# Altium schematic sheet CHARGING IC.SchDoc
size C
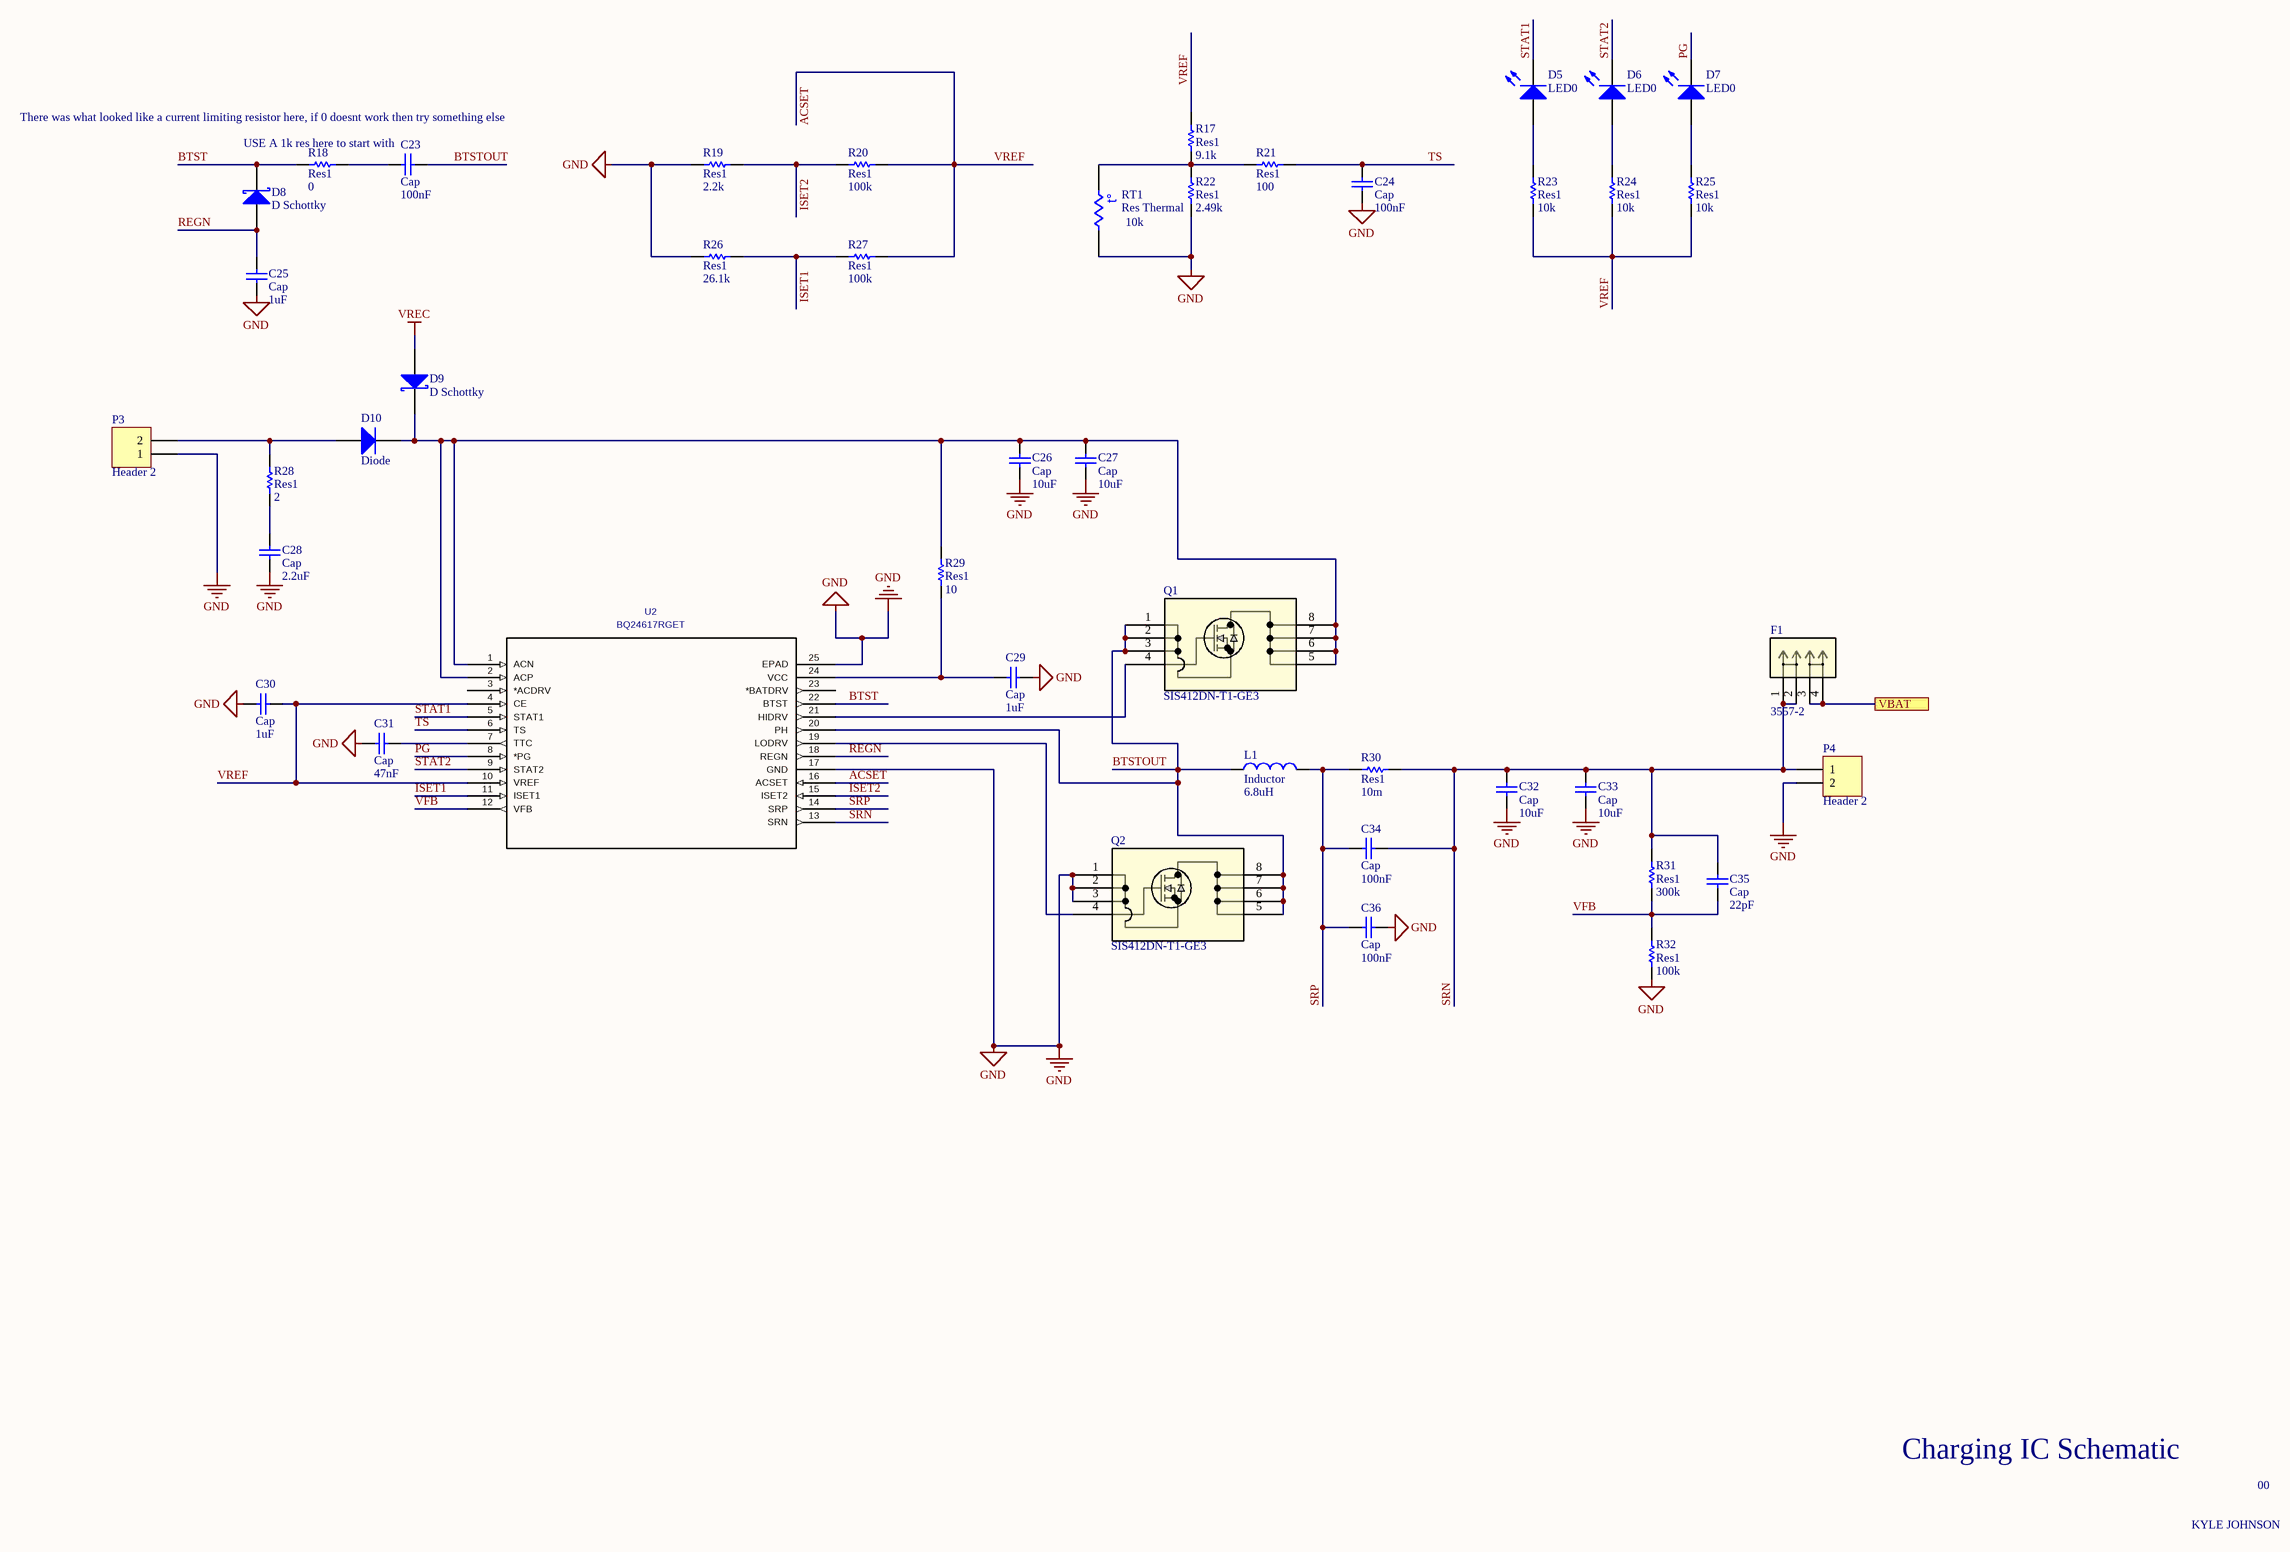
[diagram p0: CHARGING IC.SchDoc]

## Parts
C23  Cap  value 100nF  [0402-A]
C24  Cap  value 100nF  [0402-A]
C25  Cap  value 1uF  [0402-A]
C26  Cap  value 10uF  [6-0805_M]
C27  Cap  value 10uF  [6-0805_M]
C28  Cap  value 2.2uF  [1608[0603]]
C29  Cap  value 1uF  [0402-A]
C30  Cap  value 1uF  [0402-A]
C31  Cap  value 47nF  [0402-A]
C32  Cap  value 10uF  [6-0805_M]
C33  Cap  value 10uF  [6-0805_M]
C34  Cap  value 100nF  [0402-A]
C35  Cap  value 22pF  [0402-A]
C36  Cap  value 100nF  [0402-A]
D5  LED0  [1608[0603]]
D6  LED0  [1608[0603]]
D7  LED0  [1608[0603]]
D8  D Schottky  [425]
D9  D Schottky  [425]
D10  Diode  [X3-WLB1608-2]
F1  3557-2  [CONN_3557-2_KEY]
L1  Inductor  value 6.8uH  [IHLP2525CZER6R8MA1]
P3  Header 2  [2-1445096-2]
P4  Header 2  [2-1445096-2]
Q1  SIS412DN-T1-GE3  [POWERPAK_1212-8]
Q2  SIS412DN-T1-GE3  [POWERPAK_1212-8]
R17  Res1  value 9.1k  [0402-A]
R18  Res1  value 0  [0402-A]
R19  Res1  value 2.2k  [0402-A]
R20  Res1  value 100k  [0402-A]
R21  Res1  value 100  [0402-A]
R22  Res1  value 2.49k  [0402-A]
R23  Res1  value 10k  [0402-A]
R24  Res1  value 10k  [0402-A]
R25  Res1  value 10k  [0402-A]
R26  Res1  value 26.1k  [0402-A]
R27  Res1  value 100k  [0402-A]
R28  Res1  value 2  [6-0805_M]
R29  Res1  value 10  [0402-A]
R30  Res1  value 10m  [6-0805_M]
R31  Res1  value 300k  [0402-A]
R32  Res1  value 100k  [0402-A]
RT1  Res Thermal  value 10k  [1608[0603]]
U2  BQ24617RGET  [RGE24_2P45X2P45]

## Ports
VBAT

## Nets
GND: C24.1 C25.1 C26.1 C27.1 C28.1 C29.2 C30.2 C31.1 C32.1 C33.1 C36.2 P3.1 P4.2 Q2.1(S) Q2.2(S) Q2.3(S) R19.1 R22.1 R26.1 R32.1 RT1.2 U2.17(GND) U2.25(EPAD)
VREC: D9.1(A)
ACSET: C30.1 R17.2 R20.2 R23.1 R24.1 R25.1 R27.2 U2.4(CE) U2.10(VREF) U2.16(ACSET)  [also labelled VREF]
BTST: D8.2(K) R18.1 U2.22(BTST)
BTSTOUT: C23.2 L1.1 Q1.1(S) Q1.2(S) Q1.3(S) Q2.5(D) Q2.6(D) Q2.7(D) Q2.8(D) U2.20(PH)
ISET1: R26.2 R27.1 U2.11(ISET1)
ISET2: R19.2 R20.1 U2.15(ISET2)
PG: D7.2(K) U2.8(*PG)
REGN: C25.2 D8.1(A) U2.18(REGN)
SRN: C32.2 C33.2 C34.1 C35.1 F1.1 F1.2 P4.1 R30.2 R31.2 U2.13(SRN)
SRP: C34.2 C36.1 L1.2 R30.1 U2.14(SRP)
STAT1: D5.2(K) U2.5(STAT1)
STAT2: D6.2(K) U2.9(STAT2)
TS: C24.2 R21.2 U2.6(TS)
VBAT: F1.3 F1.4 ; port VBAT
VFB: C35.2 R31.1 R32.2 U2.12(VFB)
NetC23_1: C23.1 R18.2
NetC26_2: C26.2 C27.2 D9.2(K) D10.2(K) Q1.5(D) Q1.6(D) Q1.7(D) Q1.8(D) R29.2 U2.1(ACN) U2.2(ACP)
NetC28_2: C28.2 R28.1
NetC29_1: C29.1 R29.1 U2.24(VCC)
NetC31_2: C31.2 U2.7(TTC)
NetD5_1: D5.1(A) R23.2
NetD6_1: D6.1(A) R24.2
NetD7_1: D7.1(A) R25.2
NetD10_1: D10.1(A) P3.2 R28.2
NetQ1_4: Q1.4(G) U2.21(HIDRV)
NetQ2_4: Q2.4(G) U2.19(LODRV)
NetR17_1: R17.1 R21.1 R22.2 RT1.1

Not connected (* = marked no-connect by the designer): U2 3(*ACDRV) 23(*BATDRV)

## Notes on the sheet
- There was what looked like a current limiting resistor here, if 0 doesnt work then try something else
- USE A 1k res here to start with
- Charging IC Schematic
- KYLE JOHNSON
- 00
- (in symbol Res Thermal) t°

## Library data of the parts
C23-C36 = Cap: Capacitor; Published: 8-Jun-2000; LatestRevisionDate: 17-Jul-2002; LatestRevisionNote: Re-released for DXP Platform.; PackageReference: RAD-0.3; Publisher: Altium Limited; PackageDescription: Radial Cap, Thru-Hole; 2 Leads; 0.3 in Pin Spacing
D8 D9 = D Schottky: Schottky Diode; Published: 8-Jun-2000; LatestRevisionDate: 17-Jul-2002; LatestRevisionNote: Re-released for DXP Platform.; PackageReference: SMB; Publisher: Altium Limited; PackageDescription: DO-214-AA/SMB; 2 C-Bend Leads; Body 5.3 x 3.6 mm, inc. leads (LxW); Code_JEDEC: DO-214-AA
D10 = Diode: Default Diode; Published: 8-Jun-2000; LatestRevisionDate: 17-Jul-2002; LatestRevisionNote: Re-released for DXP Platform.; PackageVersion: Sep-1996; PackageReference: SMC; Publisher: Altium Limited; PackageDescription: DO-214-AB/SMC; 2 C-Bend Leads; Body 7.9 x 5.9 mm, inc. leads (LxW); Code_JEDEC: DO-214-AB
F1 = 3557-2: No Description Available; Vendor: Keystone Electronics; Built_By: EMA_Cory; SourceLibrary: Keystone Electronics_Complete_2020-01-22; Type: DEV; Manufacturer_Part_Number: 3557-2; Copyright: Copyright (C) 2018 Accelerated Designs. All rights reserved; RefDes: RefDes
L1 = Inductor: Code_IEC: 1005; Published: 8-Jun-2000; LatestRevisionDate: 29-May-2009; LatestRevisionNote: IPC-7351 Footprint Added.; PackageReference: 0402-A; Publisher: Altium Limited; PackageDescription: Chip Inductor; Code_JEITA: 0402
P3 P4 = Header 2: Header, 2-Pin; LatestRevisionDate: 17-Jul-2002; LatestRevisionNote: Re-released for DXP Platform.; Publisher: Altium Limited
Q1 Q2 = SIS412DN-T1-GE3: No Description Available; Vendor: Vishay; Built_By: EMA_Cory; Type: DEV; Datasheet: https://www.vishay.com/docs/69006/sis412dn.pdf; Manufacturer_Part_Number: SIS412DN-T1-GE3; Copyright: Copyright (C) 2018 Accelerated Designs. All rights reserved; RefDes: RefDes
R17-R32 = Res1: Resistor; Published: 8-Jun-2000; LatestRevisionDate: 17-Jul-2002; LatestRevisionNote: Re-released for DXP Platform.; PackageReference: AXIAL-0.3; Publisher: Altium Limited; PackageDescription: Axial Device, Thru-Hole; 2 Leads; 0.3 in Pin Spacing
RT1 = Res Thermal: Thermistor; Published: 24-Mar-1999; LatestRevisionDate: 29-May-2009; LatestRevisionNote: IPC-7351 Footprint Added.; PackageVersion: Mar-2003; PackageReference: 6-0805; Publisher: Altium Limited; PackageDescription: Chip Resistor 0805 Case Size; Code_IPC: RESC2012
U2 = BQ24617RGET: Manufacturer: Texas Instruments; C: Copyright (C) 2015 Accelerated Designs. All rights reserved; Built_By: EMA_UL_Team; Value: BQ24617RGET; Vendor: Vendor; Manufacturer_Part_Number: BQ24617RGET
D5-D7 = LED0: Published: 8-Jun-2000; LatestRevisionDate: 08-Jul-2005; LatestRevisionNote: Mech Layer 1 removed.; PackageReference: LED-0; Publisher: Altium Limited; PackageDescription: LED; 2 Leads